# Altium schematic sheet airu-board_2.SchDoc
size 296 x 229 mm
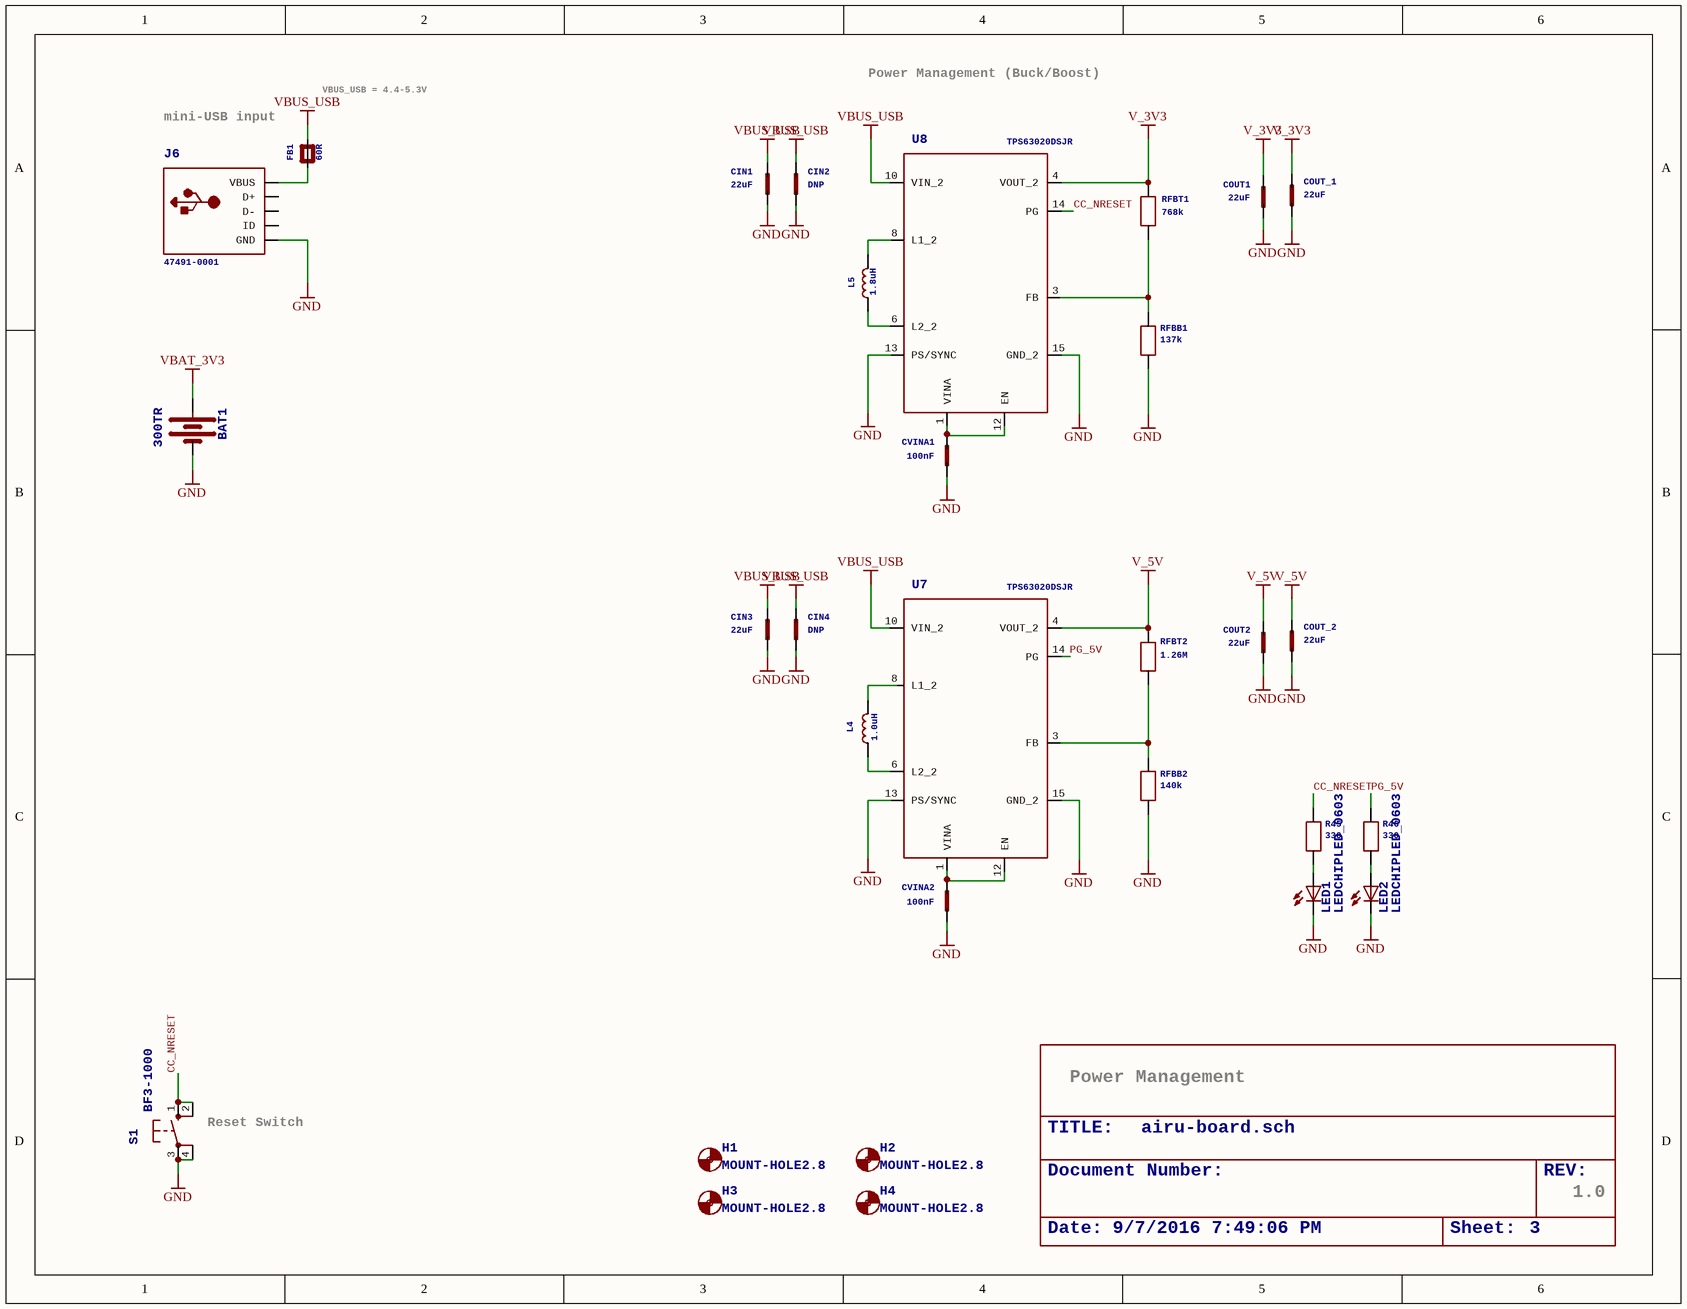
[diagram p0: airu-board_2.SchDoc]

## Parts
BAT1  300TR  [BATTCON_12MM]
CIN1  22uF  [1206_190]
CIN2  DNP  [1206_190]
CIN3  22uF  [1206_190]
CIN4  DNP  [1206_190]
COUT1  22uF  [0805]
COUT2  22uF  [0805]
COUT_1  22uF  [0805]
COUT_2  22uF  [0805]
CVINA1  100nF  [0603]
CVINA2  100nF  [0603]
FB1  60R  [_0402]
FRAME2  FRAME_A_L  (value not drawn)  (parts A,B of 2)
H1  MOUNT-HOLE2.8  [2,8]
H2  MOUNT-HOLE2.8  [2,8]
H3  MOUNT-HOLE2.8  [2,8]
H4  MOUNT-HOLE2.8  [2,8]
J6  47491-0001  [USB-MINIB]
L4  1.0uH  [SRN3015]
L5  1.8uH  [SDR0403]
LED1  LEDCHIPLED_0603  [CHIPLED_0603]
LED2  LEDCHIPLED_0603  [CHIPLED_0603]
R45  330  [0402]
R46  330  [0402]
RFBB1  137k  [0402]
RFBB2  140k  [0402]
RFBT1  768k  [0402]
RFBT2  1.26M  [0805]
S1  BF3-1000  [B3F-10XX]
U7  TPS63020DSJR  [R-PVSON-N14]
U8  TPS63020DSJR  [R-PVSON-N14]

## Nets
GND: BAT1.GND(-) CIN1.2 CIN2.2 CIN3.2 CIN4.2 COUT1.2 COUT2.2 COUT_1.2 COUT_2.2 CVINA1.2 CVINA2.2 J6.GND LED1.C LED2.C RFBB1.P2 RFBB2.P2 S1.3(P) S1.4(P1) U7.13(PS/SYNC) U7.15(GND_2) U8.13(PS/SYNC) U8.15(GND_2)
V_3V3: COUT1.1 COUT_1.1 RFBT1.P1 U8.4(VOUT_2)
V_5V: COUT2.1 COUT_2.1 RFBT2.1 U7.4(VOUT_2)
VBAT_3V3: BAT1.PWR@1(+)
VBUS_USB: CIN1.1 CIN2.1 CIN3.1 CIN4.1 FB1.2(P$2) U7.10(VIN_2) U8.10(VIN_2)
CC_NRESET: R45.P1 S1.1(S) S1.2(S1) U8.14(PG)
PG_5V: R46.P1 U7.14(PG)
NetCVINA1_1: CVINA1.1 U8.1(VINA) U8.12(EN)
NetCVINA2_1: CVINA2.1 U7.1(VINA) U7.12(EN)
NetFB1_1: FB1.1(P$1) J6.VBUS
NetL4_1: L4.1 U7.6(L2_2)
NetL4_2: L4.2 U7.8(L1_2)
NetL5_1: L5.1 U8.6(L2_2)
NetL5_2: L5.2 U8.8(L1_2)
NetLED1_A: LED1.A R45.P2
NetLED2_A: LED2.A R46.P2
NetRFBB1_P1: RFBB1.P1 RFBT1.P2 U8.3(FB)
NetRFBB2_P1: RFBB2.P1 RFBT2.2 U7.3(FB)

Not connected (* = marked no-connect by the designer): J6 D+ D- ID

## Notes on the sheet
- VBUS_USB = 4.4-5.3V
- Power Management (Buck/Boost)
- mini-USB input
- Power Management
- (near S1) Reset Switch
- 1.0

## Library data of the parts
BAT1 = BATTERY12MM: <b>Battery Holders</b><br> / Various common sizes : AA, AAA, 18650 (PRT-12895), 20mm coin cell and 12mm coin cell.<br> / 20MM_4LEGS, BATT-10373
CIN1-CIN4 = GRM31CR61A226KE19L
COUT1 COUT2 COUT_1 COUT_2 = GRM21BR60J226ME39L
CVINA1 CVINA2 = C0603C104K8RACTU
FB1 = FERRITE_0402: <p><b>Ferrite Bead</b></p> / <p>0603</p> / <ul> / <li>MMZ1608B121C - 120 Ohm @ 100MHz, 600mA, 0.15 Ohm DC Resistance - Digikey: 445-2164-1-ND</li> / <li>BK1608HW121-T - 120 Ohm, 600mA Ferrite Chip - Digikey: 587-1876-2-ND</li> / </ul> / <p>0805</p> / <ul> / <li>HZ0805B272R-10 - 2.7K Ohm @ 100MHz, 200mA, 0.8 Ohm DC Resistance - Digikey: 240-2504-1-ND (see also Murata BLM21BD272SN1L)</li> / <li>MMZ2012Y152B - 1.5K Ohm @ 100MHz, 500mA, 0.4 Ohm DC Resistance - Digikey: 445-1560-1-ND - Mainly for high frequency (80-400MHz)</li> / <li>MMZ2012R102A - 1K Ohm @ 100MHz, 500mA, 0.3 Ohm DC Resistance - Digikey: 445-1555-2-ND - More general purpose (10-200MHz)</li> / </ul>
FRAME2 = FRAME_A_L: <b>FRAME</b> A Size , 8 1/2 x 11 INCH, Landscape<p>
H1-H4 = MOUNT-HOLE2.8: <b>MOUNTING HOLE</b> with drill center marker
J6 = USBMINIB: <p><b>USB Connectors</b></p> / <b>USBMINIB</b> - Surface Mount Female Mini-B USB Connector 4UConnector: 06564</p> / <p>By microbuilder.eu</p> / Thru-hole RA Female Mini-B USB Connector 4UConnector: 18732</p> / <p>By ladyada.net</p>
L4 = SRN3015-1R0Y
L5 = SDR0403-1R8ML
LED1 LED2 = LEDCHIPLED_0603: <b>LED</b><p> / <u>OSRAM</u>:<br> / - <u>CHIPLED</u><br> / LG R971, LG N971, LY N971, LG Q971, LY Q971, LO R971, LY R971 / LH N974, LH R974<br> / LS Q976, LO Q976, LY Q976<br> / LO Q996<br> / - <u>Hyper CHIPLED</u><br> / LW Q18S<br> / LB Q993, LB Q99A, LB R99A<br> / - <u>SideLED</u><br> / LS A670, LO A670, LY A670, LG A670, LP A670<br> / LB A673, LV A673, LT A673, LW A673<br> / LH A674<br> / LY A675<br> / LS A676, LA A676, LO A676, LY A676, LW A676<br> / LS A679, LY A679, LG A679<br> / -  <u>Hyper Micro SIDELED®</u><br> / LS Y876, LA Y876, LO Y876, LY Y876<br> / LT Y87S<br> / - <u>SmartLED</u><br> / LW L88C, LW L88S<br> / LB L89C, LB L89S, LG L890<br> / LS L89K, LO L89K, LY L89K<br> / LS L896, LA L896, LO L896, LY L896<br> / - <u>TOPLED</u><br> / LS T670, LO T670, LY T670, LG T670, LP T670<br> / LSG T670, LSP T670, LSY T670, LOP T670, LYG T670<br> / LG T671, LOG T671, LSG T671<br> / LB T673, LV T673, LT T673, LW T673<br> / LH T674<br> / LS T676, LA T676, LO T676, LY T676, LB T676, LH T676, LSB T676, LW T676<br> / LB T67C, LV T67C, LT T67C, LS T67K, LO T67K, LY T67K, LW E67C<br> / LS E67B, LA E67B, LO E67B, LY E67B, LB E67C, LV E67C, LT E67C<br> / LW T67C<br> / LS T679, LY T679, LG T679<br> / LS T770, LO T770, LY T770, LG T770, LP T770<br> / LB T773, LV T773, LT T773, LW T773<br> / LH T774<br> / LS E675, LA E675, LY E675, LS T675<br> / LS T776, LA T776, LO T776, LY T776, LB T776<br> / LHGB T686<br> / LT T68C, LB T68C<br> / - <u>Hyper Mini TOPLED®</u><br> / LB M676<br> / - <u>Mini TOPLED Santana®</u><br> / LG M470<br> / LS M47K, LO M47K, LY M47K / <p> / Source: http://www.osram.convergy.de<p> / <u>LUXEON:</u><br> / - <u>LUMILED®</u><br> / LXK2-PW12-R00, LXK2-PW12-S00, LXK2-PW14-U00, LXK2-PW14-V00<br> / LXK2-PM12-R00, LXK2-PM12-S00, LXK2-PM14-U00<br> / LXK2-PE12-Q00, LXK2-PE12-R00, LXK2-PE12-S00, LXK2-PE14-T00, LXK2-PE14-U00<br> / LXK2-PB12-K00, LXK2-PB12-L00, LXK2-PB12-M00, LXK2-PB14-N00, LXK2-PB14-P00, LXK2-PB14-Q00<br> / LXK2-PR12-L00, LXK2-PR12-M00, LXK2-PR14-Q00, LXK2-PR14-R00<br> / LXK2-PD12-Q00, LXK2-PD12-R00, LXK2-PD12-S00<br> / LXK2-PH12-R00, LXK2-PH12-S00<br> / LXK2-PL12-P00, LXK2-PL12-Q00, LXK2-PL12-R00 / <p> / Source: www.luxeon.com<p> / <u>KINGBRIGHT:</U><p> / KA-3528ASYC<br> / Source: www.kingbright.com
R45 R46 RFBB1 RFBB2 = CRCW0402137KFKED
RFBT1 = CRCW0402768KFKED
RFBT2 = RT0805BRD071M26L
S1 = 10-XX: <b>OMRON SWITCH</b>